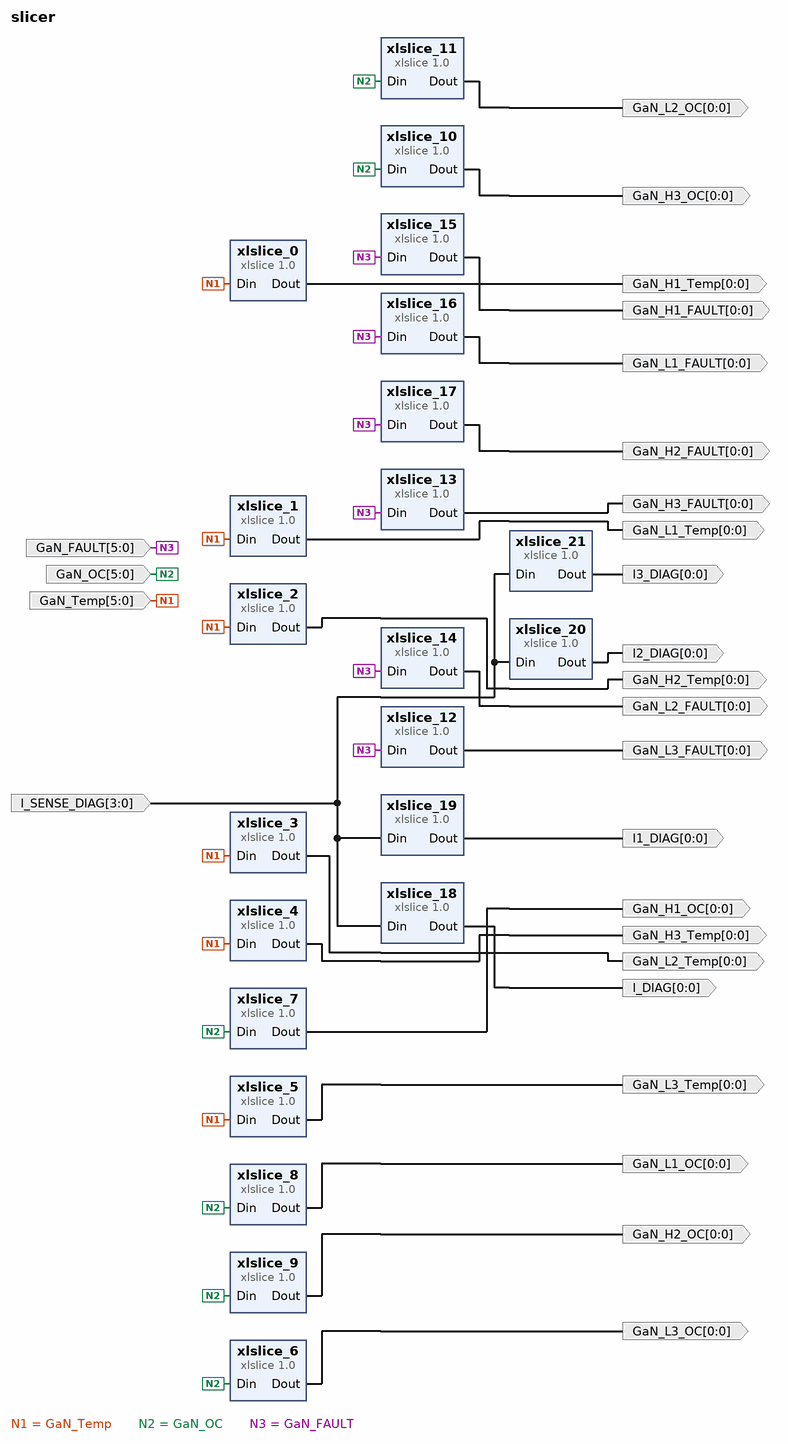
[diagram p0: block diagram of the top level]
# Vivado block design slicer, xczu9eg-ffvc900-1-i, Vivado 2020.1.1
create_bd_design slicer

create_bd_port -dir I -from 5 -to 0 GaN_Temp
create_bd_port -dir I -from 5 -to 0 GaN_OC
create_bd_port -dir I -from 3 -to 0 I_SENSE_DIAG
create_bd_port -dir O -from 0 -to 0 GaN_H1_Temp
create_bd_port -dir O -from 0 -to 0 GaN_L1_Temp
create_bd_port -dir O -from 0 -to 0 GaN_H2_Temp
create_bd_port -dir O -from 0 -to 0 GaN_L2_Temp
create_bd_port -dir O -from 0 -to 0 GaN_H3_Temp
create_bd_port -dir O -from 0 -to 0 GaN_L3_Temp
create_bd_port -dir O -from 0 -to 0 GaN_H1_OC
create_bd_port -dir O -from 0 -to 0 GaN_L1_OC
create_bd_port -dir O -from 0 -to 0 GaN_H2_OC
create_bd_port -dir O -from 0 -to 0 GaN_L2_OC
create_bd_port -dir O -from 0 -to 0 GaN_H3_OC
create_bd_port -dir O -from 0 -to 0 GaN_L3_OC
create_bd_port -dir O -from 0 -to 0 GaN_H1_FAULT
create_bd_port -dir O -from 0 -to 0 GaN_L1_FAULT
create_bd_port -dir O -from 0 -to 0 GaN_H2_FAULT
create_bd_port -dir O -from 0 -to 0 GaN_L2_FAULT
create_bd_port -dir O -from 0 -to 0 GaN_H3_FAULT
create_bd_port -dir O -from 0 -to 0 GaN_L3_FAULT
create_bd_port -dir O -from 0 -to 0 I_DIAG
create_bd_port -dir O -from 0 -to 0 I1_DIAG
create_bd_port -dir O -from 0 -to 0 I2_DIAG
create_bd_port -dir O -from 0 -to 0 I3_DIAG
create_bd_port -dir I -from 5 -to 0 GaN_FAULT

create_bd_cell -type ip -vlnv xilinx.com:ip:xlslice:1.0 xlslice_0
set_property -dict {CONFIG.DIN_WIDTH 6} [get_bd_cells xlslice_0]
create_bd_cell -type ip -vlnv xilinx.com:ip:xlslice:1.0 xlslice_1
set_property -dict {CONFIG.DIN_FROM 1 CONFIG.DIN_TO 1 CONFIG.DIN_WIDTH 6 CONFIG.DOUT_WIDTH 1} [get_bd_cells xlslice_1]
create_bd_cell -type ip -vlnv xilinx.com:ip:xlslice:1.0 xlslice_2
set_property -dict {CONFIG.DIN_FROM 2 CONFIG.DIN_TO 2 CONFIG.DIN_WIDTH 6 CONFIG.DOUT_WIDTH 1} [get_bd_cells xlslice_2]
create_bd_cell -type ip -vlnv xilinx.com:ip:xlslice:1.0 xlslice_3
set_property -dict {CONFIG.DIN_FROM 3 CONFIG.DIN_TO 3 CONFIG.DIN_WIDTH 6 CONFIG.DOUT_WIDTH 1} [get_bd_cells xlslice_3]
create_bd_cell -type ip -vlnv xilinx.com:ip:xlslice:1.0 xlslice_4
set_property -dict {CONFIG.DIN_FROM 4 CONFIG.DIN_TO 4 CONFIG.DIN_WIDTH 6 CONFIG.DOUT_WIDTH 1} [get_bd_cells xlslice_4]
create_bd_cell -type ip -vlnv xilinx.com:ip:xlslice:1.0 xlslice_5
set_property -dict {CONFIG.DIN_FROM 5 CONFIG.DIN_TO 5 CONFIG.DIN_WIDTH 6 CONFIG.DOUT_WIDTH 1} [get_bd_cells xlslice_5]
create_bd_cell -type ip -vlnv xilinx.com:ip:xlslice:1.0 xlslice_6
set_property -dict {CONFIG.DIN_FROM 5 CONFIG.DIN_TO 5 CONFIG.DIN_WIDTH 6 CONFIG.DOUT_WIDTH 1} [get_bd_cells xlslice_6]
create_bd_cell -type ip -vlnv xilinx.com:ip:xlslice:1.0 xlslice_7
set_property -dict {CONFIG.DIN_FROM 0 CONFIG.DIN_TO 0 CONFIG.DIN_WIDTH 6 CONFIG.DOUT_WIDTH 1} [get_bd_cells xlslice_7]
create_bd_cell -type ip -vlnv xilinx.com:ip:xlslice:1.0 xlslice_8
set_property -dict {CONFIG.DIN_FROM 1 CONFIG.DIN_TO 1 CONFIG.DIN_WIDTH 6 CONFIG.DOUT_WIDTH 1} [get_bd_cells xlslice_8]
create_bd_cell -type ip -vlnv xilinx.com:ip:xlslice:1.0 xlslice_9
set_property -dict {CONFIG.DIN_FROM 2 CONFIG.DIN_TO 2 CONFIG.DIN_WIDTH 6 CONFIG.DOUT_WIDTH 1} [get_bd_cells xlslice_9]
create_bd_cell -type ip -vlnv xilinx.com:ip:xlslice:1.0 xlslice_10
set_property -dict {CONFIG.DIN_FROM 4 CONFIG.DIN_TO 4 CONFIG.DIN_WIDTH 6 CONFIG.DOUT_WIDTH 1} [get_bd_cells xlslice_10]
create_bd_cell -type ip -vlnv xilinx.com:ip:xlslice:1.0 xlslice_11
set_property -dict {CONFIG.DIN_FROM 3 CONFIG.DIN_TO 3 CONFIG.DIN_WIDTH 6 CONFIG.DOUT_WIDTH 1} [get_bd_cells xlslice_11]
create_bd_cell -type ip -vlnv xilinx.com:ip:xlslice:1.0 xlslice_12
set_property -dict {CONFIG.DIN_FROM 5 CONFIG.DIN_TO 5 CONFIG.DIN_WIDTH 6 CONFIG.DOUT_WIDTH 1} [get_bd_cells xlslice_12]
create_bd_cell -type ip -vlnv xilinx.com:ip:xlslice:1.0 xlslice_13
set_property -dict {CONFIG.DIN_FROM 4 CONFIG.DIN_TO 4 CONFIG.DIN_WIDTH 6 CONFIG.DOUT_WIDTH 1} [get_bd_cells xlslice_13]
create_bd_cell -type ip -vlnv xilinx.com:ip:xlslice:1.0 xlslice_14
set_property -dict {CONFIG.DIN_FROM 3 CONFIG.DIN_TO 3 CONFIG.DIN_WIDTH 6 CONFIG.DOUT_WIDTH 1} [get_bd_cells xlslice_14]
create_bd_cell -type ip -vlnv xilinx.com:ip:xlslice:1.0 xlslice_15
set_property -dict {CONFIG.DIN_FROM 0 CONFIG.DIN_TO 0 CONFIG.DIN_WIDTH 6 CONFIG.DOUT_WIDTH 1} [get_bd_cells xlslice_15]
create_bd_cell -type ip -vlnv xilinx.com:ip:xlslice:1.0 xlslice_16
set_property -dict {CONFIG.DIN_FROM 1 CONFIG.DIN_TO 1 CONFIG.DIN_WIDTH 6 CONFIG.DOUT_WIDTH 1} [get_bd_cells xlslice_16]
create_bd_cell -type ip -vlnv xilinx.com:ip:xlslice:1.0 xlslice_17
set_property -dict {CONFIG.DIN_FROM 2 CONFIG.DIN_TO 2 CONFIG.DIN_WIDTH 6 CONFIG.DOUT_WIDTH 1} [get_bd_cells xlslice_17]
create_bd_cell -type ip -vlnv xilinx.com:ip:xlslice:1.0 xlslice_18
set_property -dict {CONFIG.DIN_WIDTH 4} [get_bd_cells xlslice_18]
create_bd_cell -type ip -vlnv xilinx.com:ip:xlslice:1.0 xlslice_19
set_property -dict {CONFIG.DIN_FROM 1 CONFIG.DIN_TO 1 CONFIG.DIN_WIDTH 4 CONFIG.DOUT_WIDTH 1} [get_bd_cells xlslice_19]
create_bd_cell -type ip -vlnv xilinx.com:ip:xlslice:1.0 xlslice_20
set_property -dict {CONFIG.DIN_FROM 2 CONFIG.DIN_TO 2 CONFIG.DIN_WIDTH 4 CONFIG.DOUT_WIDTH 1} [get_bd_cells xlslice_20]
create_bd_cell -type ip -vlnv xilinx.com:ip:xlslice:1.0 xlslice_21
set_property -dict {CONFIG.DIN_FROM 3 CONFIG.DIN_TO 3 CONFIG.DIN_WIDTH 4 CONFIG.DOUT_WIDTH 1} [get_bd_cells xlslice_21]

# ---- connections ----

connect_bd_net [get_bd_ports GaN_Temp] \
  [get_bd_pins xlslice_0/Din] [get_bd_pins xlslice_2/Din] [get_bd_pins xlslice_3/Din] [get_bd_pins xlslice_4/Din] \
  [get_bd_pins xlslice_5/Din] [get_bd_pins xlslice_1/Din]
connect_bd_net [get_bd_ports GaN_OC] \
  [get_bd_pins xlslice_11/Din] [get_bd_pins xlslice_8/Din] [get_bd_pins xlslice_9/Din] [get_bd_pins xlslice_10/Din] \
  [get_bd_pins xlslice_6/Din] [get_bd_pins xlslice_7/Din]
connect_bd_net [get_bd_ports GaN_FAULT] \
  [get_bd_pins xlslice_15/Din] [get_bd_pins xlslice_16/Din] [get_bd_pins xlslice_17/Din] [get_bd_pins xlslice_14/Din] \
  [get_bd_pins xlslice_13/Din] [get_bd_pins xlslice_12/Din]
connect_bd_net -net I_DIAG_1 [get_bd_ports I_SENSE_DIAG] \
  [get_bd_pins xlslice_18/Din] [get_bd_pins xlslice_19/Din] [get_bd_pins xlslice_20/Din] [get_bd_pins xlslice_21/Din]
connect_bd_net [get_bd_pins xlslice_0/Dout] [get_bd_ports GaN_H1_Temp]
connect_bd_net [get_bd_pins xlslice_1/Dout] [get_bd_ports GaN_L1_Temp]
connect_bd_net [get_bd_pins xlslice_2/Dout] [get_bd_ports GaN_H2_Temp]
connect_bd_net [get_bd_pins xlslice_3/Dout] [get_bd_ports GaN_L2_Temp]
connect_bd_net [get_bd_pins xlslice_4/Dout] [get_bd_ports GaN_H3_Temp]
connect_bd_net [get_bd_pins xlslice_5/Dout] [get_bd_ports GaN_L3_Temp]
connect_bd_net [get_bd_pins xlslice_7/Dout] [get_bd_ports GaN_H1_OC]
connect_bd_net [get_bd_pins xlslice_8/Dout] [get_bd_ports GaN_L1_OC]
connect_bd_net [get_bd_pins xlslice_9/Dout] [get_bd_ports GaN_H2_OC]
connect_bd_net [get_bd_pins xlslice_11/Dout] [get_bd_ports GaN_L2_OC]
connect_bd_net [get_bd_pins xlslice_10/Dout] [get_bd_ports GaN_H3_OC]
connect_bd_net [get_bd_pins xlslice_6/Dout] [get_bd_ports GaN_L3_OC]
connect_bd_net [get_bd_pins xlslice_15/Dout] [get_bd_ports GaN_H1_FAULT]
connect_bd_net [get_bd_pins xlslice_16/Dout] [get_bd_ports GaN_L1_FAULT]
connect_bd_net [get_bd_pins xlslice_17/Dout] [get_bd_ports GaN_H2_FAULT]
connect_bd_net [get_bd_pins xlslice_14/Dout] [get_bd_ports GaN_L2_FAULT]
connect_bd_net [get_bd_pins xlslice_13/Dout] [get_bd_ports GaN_H3_FAULT]
connect_bd_net [get_bd_pins xlslice_12/Dout] [get_bd_ports GaN_L3_FAULT]
connect_bd_net [get_bd_pins xlslice_18/Dout] [get_bd_ports I_DIAG]
connect_bd_net [get_bd_pins xlslice_19/Dout] [get_bd_ports I1_DIAG]
connect_bd_net [get_bd_pins xlslice_20/Dout] [get_bd_ports I2_DIAG]
connect_bd_net [get_bd_pins xlslice_21/Dout] [get_bd_ports I3_DIAG]

validate_bd_design
save_bd_design
